# Altium schematic sheet Sheet.SchDoc
size A3; Organization: Altium Limited; Address1: L3, 12a Rodborough Rd; Address2: Frenchs Forest; Address3: NSW; Address4: Australia 2086
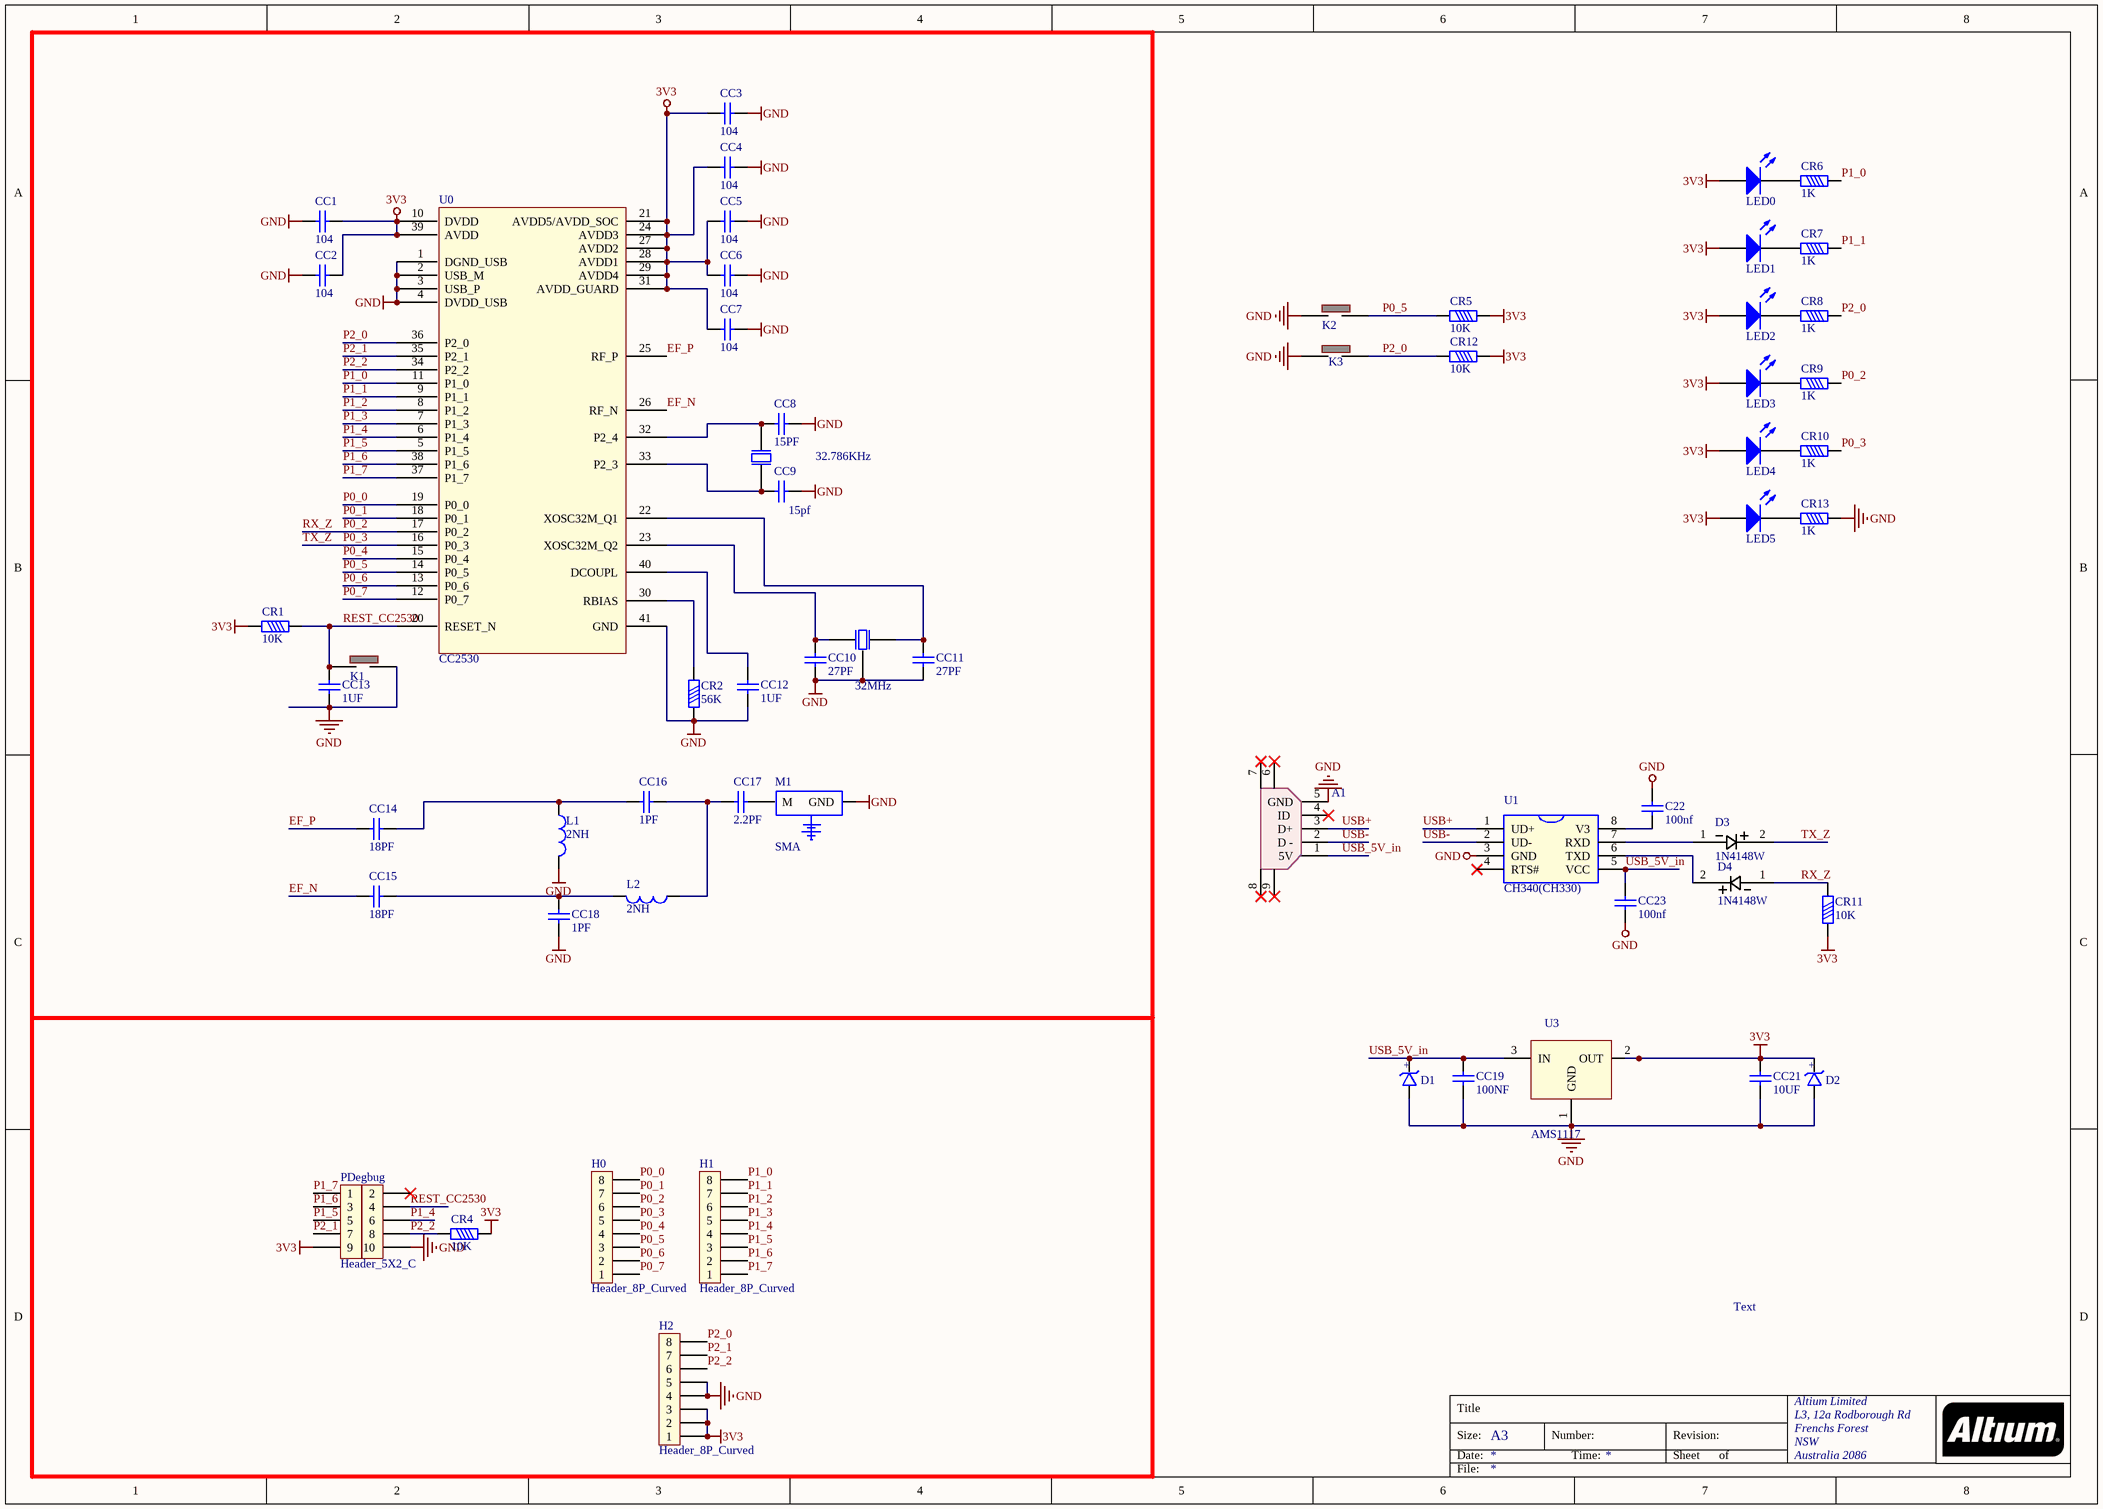
[diagram p0: Sheet.SchDoc]

## Parts
32.786KHz  XTAL 3215 32.768kKHz  [T 3215]  (value not drawn)
32MHz  XTAL 3225 8M  [T 3225]  (value not drawn)
A1  Micro USB  [Micro USB]  (value not drawn)
C22  value 100nf  [CC1608-0603]  (hidden comment: Cap Chip 0603)
CC1  value 104  [CC1608-0603]  (hidden comment: Cap Chip 0603)
CC2  value 104  [CC1608-0603]  (hidden comment: Cap Chip 0603)
CC3  value 104  [CC1608-0603]  (hidden comment: Cap Chip 0603)
CC4  value 104  [CC1608-0603]  (hidden comment: Cap Chip 0603)
CC5  value 104  [CC1608-0603]  (hidden comment: Cap Chip 0603)
CC6  value 104  [CC1608-0603]  (hidden comment: Cap Chip 0603)
CC7  value 104  [CC1608-0603]  (hidden comment: Cap Chip 0603)
CC8  value 15PF  [CC1608-0603]  (hidden comment: Cap Chip 0603)
CC9  value 15pf  [CC1608-0603]  (hidden comment: Cap Chip 0603)
CC10  value 27PF  [CC1608-0603]  (hidden comment: Cap Chip 0603)
CC11  value 27PF  [CC1608-0603]  (hidden comment: Cap Chip 0603)
CC12  value 1UF  [CC1608-0603]  (hidden comment: Cap Chip 0603)
CC13  value 1UF  [CC1608-0603]  (hidden comment: Cap Chip 0603)
CC14  value 18PF  [CC1608-0603]  (hidden comment: Cap Chip 0603)
CC15  value 18PF  [CC1608-0603]  (hidden comment: Cap Chip 0603)
CC16  value 1PF  [CC1608-0603]  (hidden comment: Cap Chip 0603)
CC17  value 2.2PF  [CC1608-0603]  (hidden comment: Cap Chip 0603)
CC18  value 1PF  [CC1608-0603]  (hidden comment: Cap Chip 0603)
CC19  value 100NF  [CC1608-0603]  (hidden comment: Cap Chip 0603)
CC21  value 10UF  [CC1608-0603]  (hidden comment: Cap Chip 0603)
CC23  value 100nf  [CC1608-0603]  (hidden comment: Cap Chip 0603)
CR1  value 10K  [CR1608-0603]  (hidden comment: Resistor Chip 0603)
CR2  value 56K  [CR1608-0603]  (hidden comment: Resistor Chip 0603)
CR4  value 10K  [CR1608-0603]  (hidden comment: Resistor Chip 0603)
CR5  value 10K  [CR1608-0603]  (hidden comment: Resistor Chip 0603)
CR6  value 1K  [CR1608-0603]  (hidden comment: Resistor Chip 0603)
CR7  value 1K  [CR1608-0603]  (hidden comment: Resistor Chip 0603)
CR8  value 1K  [CR1608-0603]  (hidden comment: Resistor Chip 0603)
CR9  value 1K  [CR1608-0603]  (hidden comment: Resistor Chip 0603)
CR10  value 1K  [CR1608-0603]  (hidden comment: Resistor Chip 0603)
CR11  value 10K  [CR1608-0603]  (hidden comment: Resistor Chip 0603)
CR12  value 10K  [CR1608-0603]  (hidden comment: Resistor Chip 0603)
CR13  value 1K  [CR1608-0603]  (hidden comment: Resistor Chip 0603)
D1  SMBJ3.3A  [DO214AA(SMB)]  (value not drawn)
D2  SMBJ3.3A  [DO214AA(SMB)]  (value not drawn)
D3  1N4148W  [SOD-123]
D4  1N4148W  [SOD-123]
H0  Header_8P_Curved  [Header_2_54_8PW]
H1  Header_8P_Curved  [Header_2_54_8PW]
H2  Header_8P_Curved  [Header_2_54_8PW]
K1  KEY 3*4  [KEY 3*4]  (value not drawn)
K2  KEY 3*4  [KEY 3*4]  (value not drawn)
K3  KEY 3*4  [KEY 3*4]  (value not drawn)
L1  value 2NH  [CR1608-0603]  (hidden comment: Inductor Chip)
L2  value 2NH  [CR1608-0603]  (hidden comment: Inductor Chip)
LED0  LED Chip  [CLED1608-0603]  (value not drawn)
LED1  LED Chip  [CLED1608-0603]  (value not drawn)
LED2  LED Chip  [CLED1608-0603]  (value not drawn)
LED3  LED Chip  [CLED1608-0603]  (value not drawn)
LED4  LED Chip  [CLED1608-0603]  (value not drawn)
LED5  LED Chip  [CLED1608-0603]  (value not drawn)
M1  SMA  [SMA-KE]
PDegbug  Header_5X2_C  [Header_10_for_zigbee]
U0  CC2530  [QLP40 (Reflow)]
U1  CH340(CH330)  [SOP8]
U3  AMS1117  [SOT-223]

## Nets
3V3: CC1.2 CC2.2 CC3.1 CC4.1 CC5.1 CC6.1 CC7.1 CC21.1 CR1.2 CR4.1 CR5.1 CR11.1 CR12.1 D2.1 H2.1 H2.2 H2.3 LED0.1(A) LED1.1(A) LED2.1(A) LED3.1(A) LED4.1(A) LED5.1(A) PDegbug.9 U0.10(DVDD) U0.21(AVDD5/AVDD_SOC) U0.24(AVDD3) U0.27(AVDD2) U0.28(AVDD1) U0.29(AVDD4) U0.31(AVDD_GUARD) U0.39(AVDD) U3.2(OUT)
GND: 32MHz.3(GND) A1.5(GND) C22.1 CC1.1 CC2.1 CC3.2 CC4.2 CC5.2 CC6.2 CC7.2 CC8.2 CC9.2 CC10.1 CC11.1 CC12.1 CC13.2 CC18.2 CC19.2 CC21.2 CC23.1 CR2.1 CR13.1 D1.2 D2.2 H2.4 H2.5 K1.2 K2.1 K3.1 L1.2 M1.2(GND) PDegbug.10 U0.1(DGND_USB) U0.2(USB_M) U0.3(USB_P) U0.4(DVDD_USB) U0.41(GND) U1.3(GND) U3.1(GND)
EF_N: CC15.2 U0.26(RF_N)
EF_P: CC14.2 U0.25(RF_P)
P0_0: H0.8 U0.19(P0_0)
P0_1: H0.7 U0.18(P0_1)
P0_2: CR9.1 CR11.2 D4.1 H0.6 U0.17(P0_2)  [also labelled RX_Z]
P0_3: CR10.1 D3.2 H0.5 U0.16(P0_3)  [also labelled TX_Z]
P0_4: H0.4 U0.15(P0_4)
P0_5: CR5.2 H0.3 K2.2 U0.14(P0_5)
P0_6: H0.2 U0.13(P0_6)
P0_7: H0.1 U0.12(P0_7)
P1_0: CR6.1 H1.8 U0.11(P1_0)
P1_1: CR7.1 H1.7 U0.9(P1_1)
P1_2: H1.6 U0.8(P1_2)
P1_3: H1.5 U0.7(P1_3)
P1_4: H1.4 PDegbug.6 U0.6(P1_4)
P1_5: H1.3 PDegbug.5 U0.5(P1_5)
P1_6: H1.2 PDegbug.3 U0.38(P1_6)
P1_7: H1.1 PDegbug.1 U0.37(P1_7)
P2_0: CR8.1 CR12.2 H2.8 K3.2 U0.36(P2_0)
P2_1: H2.7 PDegbug.7 U0.35(P2_1)
P2_2: CR4.2 H2.6 PDegbug.8 U0.34(P2_2)
REST_CC2530: CC13.1 CR1.1 K1.1 PDegbug.4 U0.20(RESET_N)
USB+: A1.3(D+) U1.1(UD+)
USB-: A1.2(D_-) U1.2(UD-)
USB_5V_in: A1.1(5V) CC19.1 CC23.2 D1.1 U1.5(VCC) U3.3(IN)
Net32.786KHz_1: 32.786KHz.1(OSC1) CC9.1 U0.33(P2_3)
Net32.786KHz_2: 32.786KHz.2(OSC2) CC8.1 U0.32(P2_4)
Net32MHz_1: 32MHz.1(OSC1) CC10.2 U0.23(XOSC32M_Q2)
Net32MHz_2: 32MHz.2(OSC2) CC11.2 U0.22(XOSC32M_Q1)
NetC22_2: C22.2 U1.8(V3)
NetCC12_2: CC12.2 U0.40(DCOUPL)
NetCC14_1: CC14.1 CC16.1 L1.1
NetCC15_1: CC15.1 CC18.1 L2.2
NetCC16_2: CC16.2 CC17.1 L2.1
NetCC17_2: CC17.2 M1.1(M)
NetCR2_2: CR2.2 U0.30(RBIAS)
NetCR6_2: CR6.2 LED0.2(K)
NetCR7_2: CR7.2 LED1.2(K)
NetCR8_2: CR8.2 LED2.2(K)
NetCR9_2: CR9.2 LED3.2(K)
NetCR10_2: CR10.2 LED4.2(K)
NetCR13_2: CR13.2 LED5.2(K)
NetD3_1: D3.1 U1.7(RXD)
NetD4_2: D4.2 U1.6(TXD)

Not connected (* = marked no-connect by the designer): A1 4(ID_)* 6* 7* 8* 9*; PDegbug 2*; U1 4(RTS#)*

## Notes on the sheet
- Text
- Title
- Size:
- Date:
- A3
- Number:
- Time:
- Revision:
- Sheet
- of
- File:
- (in symbol SMBJ3.3A) +

## Library data of the parts
C22 CC1-CC19 CC21 CC23 = Cap Chip 0603: Polarized Capacitor (Radial); Published: 8-Jun-2000; Revision: July-2002: Re-released for DXP Platform.; Publisher: Altium Limited
CR1 CR2 CR4-CR13 = Resistor Chip 0603: Resistor; Published: 8-Jun-2000; Revision: July-2002: Re-released for DXP Platform.; Publisher: Altium Limited
D1 D2 = SMBJ3.3A: 3.3V稳压管，缓解瞬间电压冲击
D3 D4 = 1N4148W: 开关二极管 贴片 1N4148W 1206/SOD-123 丝印T4 150MA 75V
H0-H2 = Header_8P_Curved: 弯的8P排针
L1 L2 = Inductor Chip: Inductor; Published: 8-Jun-2000; Revision: July-2002: Re-released for DXP Platform.; Publisher: Altium Limited
LED0-LED5 = LED Chip: Typical Chip LED; Published: 8-Jun-2000; Revision: July-2002: Re-released for DXP Platform.; Publisher: Altium Limited
M1 = SMA: 天线
PDegbug = Header_5X2_C: 双排2*5弯排针
U0 = CC2530: Zigbee
U1 = CH340(CH330): USB转串口rs232的芯片，内置晶振
U3 = AMS1117: 降压3.3V